# Altium project LiDAR_ToF_System.PrjPcb
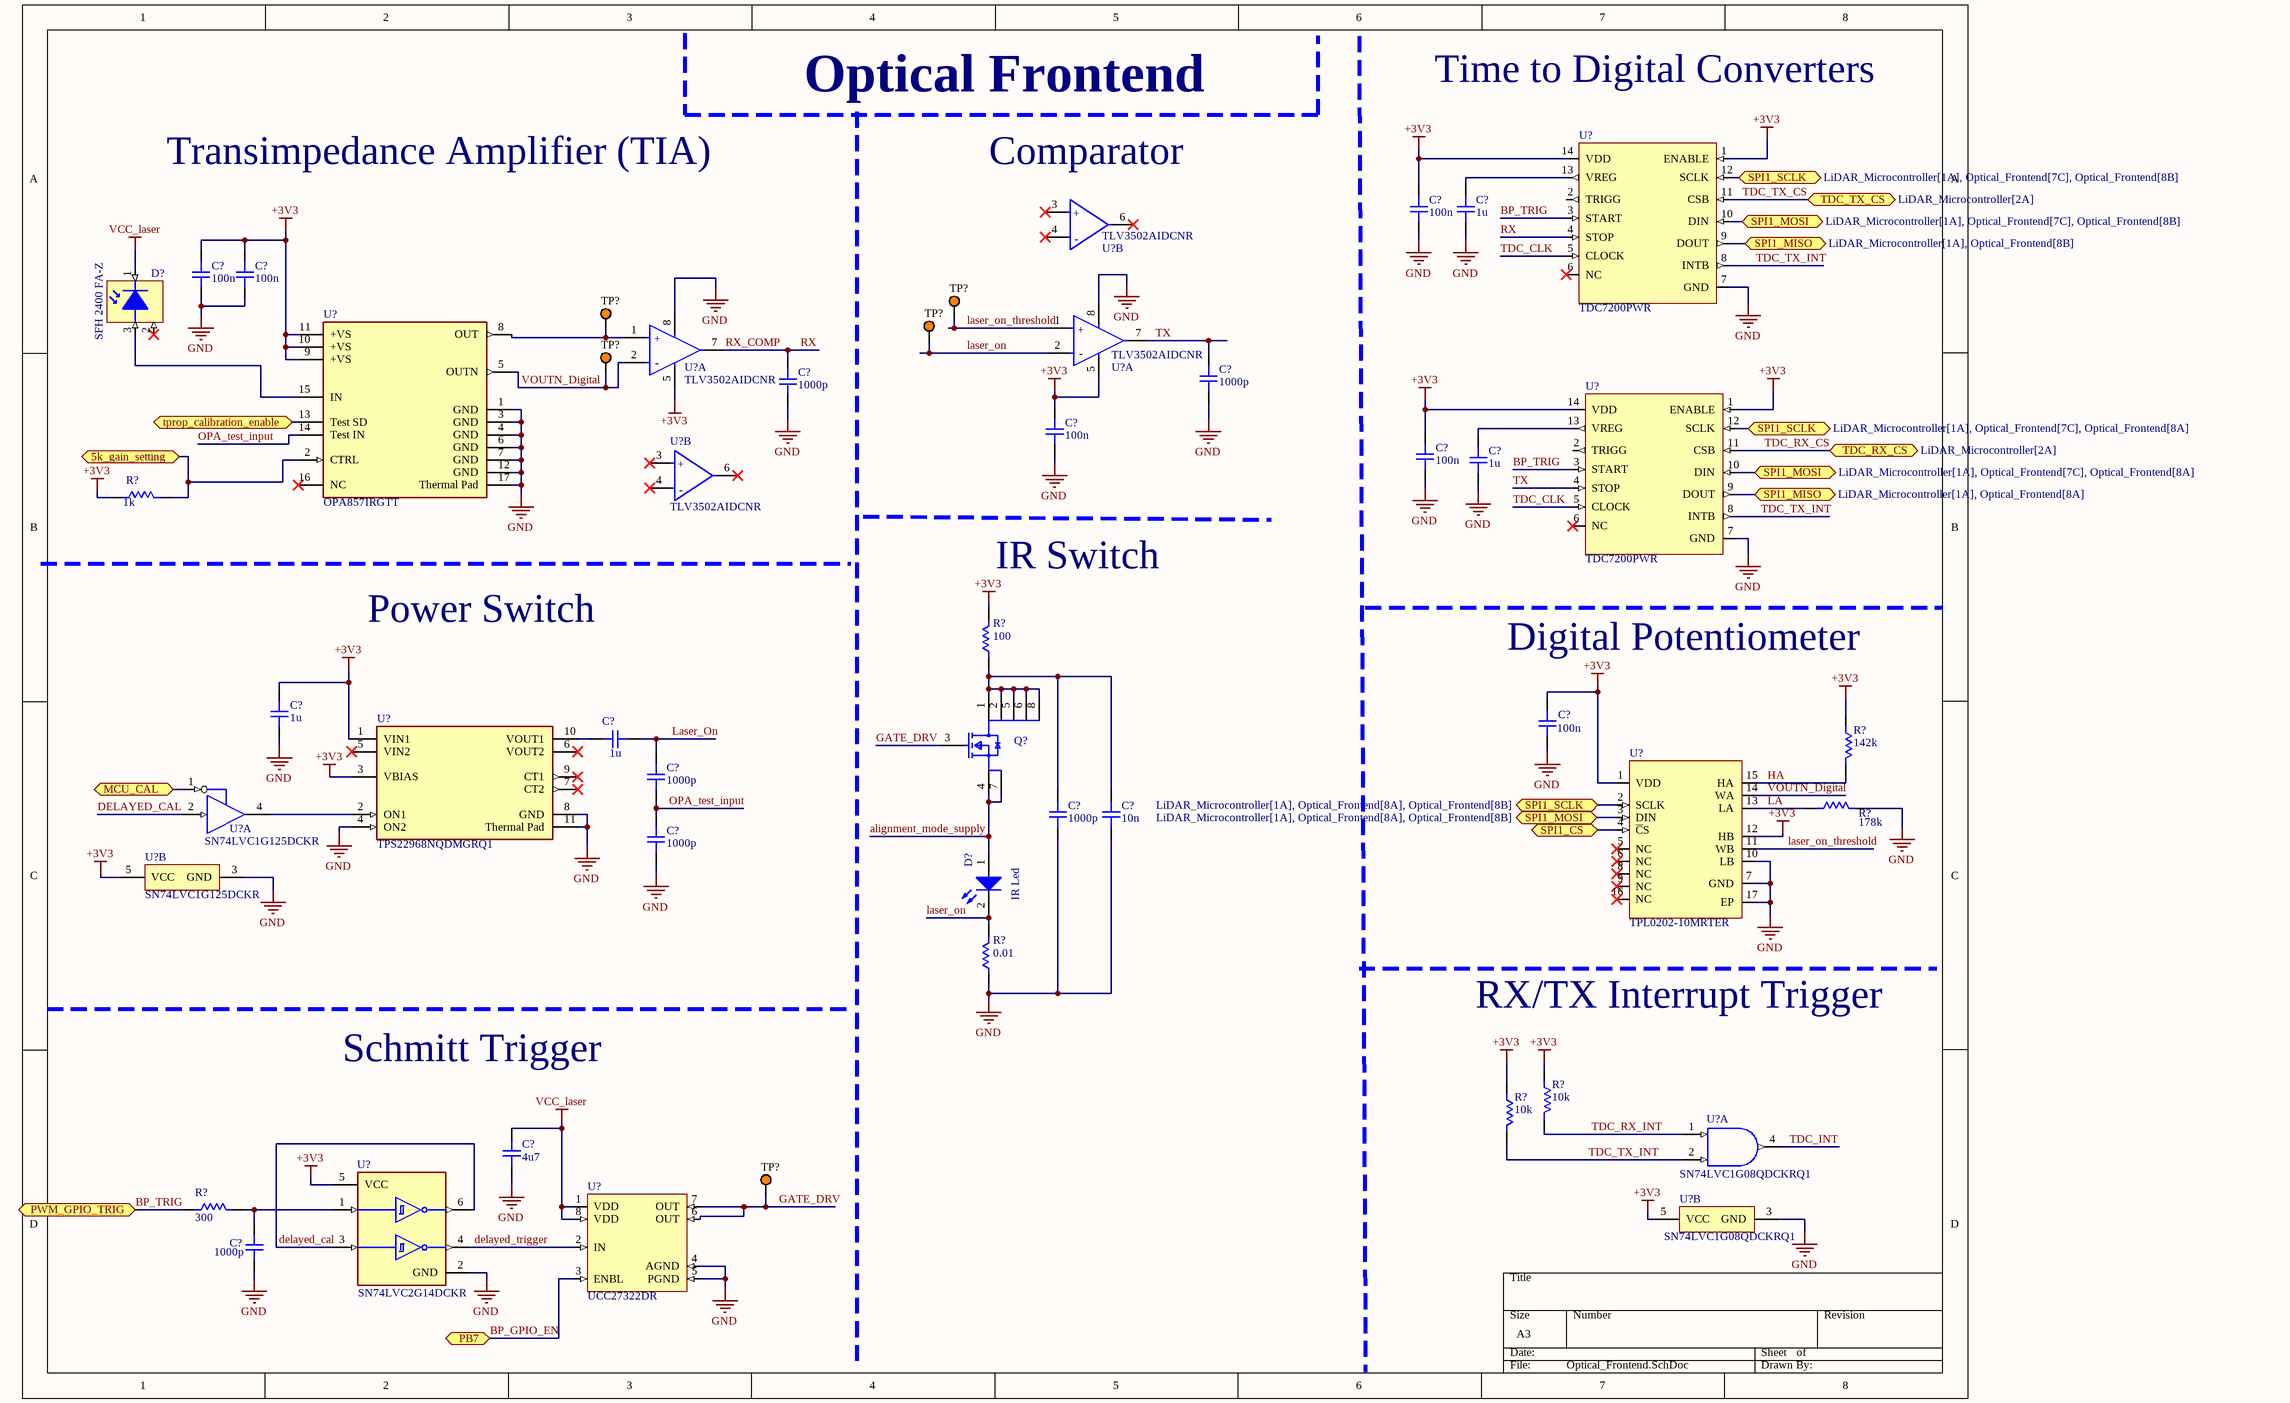
[diagram p0: Optical_Frontend.SchDoc]
2 sheets, 112 parts. Net scope: flat (ports and power ports of the same name join across sheets).
Board file: LiDAR_ToF_System.PcbDoc
Sheets:
  Optical_Frontend.SchDoc
  LiDAR_Microcontroller.SchDoc

## Sheet Optical_Frontend.SchDoc
size A3; SheetNumber: 1; SheetTotal: 2

### Parts
(Parts that share a designator on the sheet are numbered #1, #2 ... from top to bottom, then left to right.)
C?#1  100n  [CAP_0603]
C?#2  1u  [CAP_0603]
C?#3  100n  [CAP_0603]
C?#4  100n  [CAP_0603]
C?#5  1000p  [CAP_0603]
C?#6  1000p  [CAP_0603]
C?#7  100n  [CAP_0603]
C?#8  100n  [CAP_0603]
C?#9  1u  [CAP_0603]
C?#10  1u  [CAP_0603]
C?#11  100n  [CAP_0603]
C?#12  1u  [CAP_0603]
C?#13  1000p  [CAP_0603]
C?#14  1000p  [CAP_0603]
C?#15  10n  [CAP_0603]
C?#16  1000p  [CAP_0603]
C?#17  4u7  [CAP_0805]
C?#18  1000p  [CAP_0603]
D?#1  SFH 2400 FA-Z  [SFH 2400 FA-Z]
D?#2  IR Led  [WL-SITW_3528_L3.5W2.8H1.9]
Q?#1  CSD15571Q2  [FP-DQK0006C-MFG]  (value not drawn)
R?#1  1k  [RES_0603]
R?#2  100  [RES_0603]
R?#3  142k  [RES_0805]
R?#4  178k  [RES_0805]
R?#5  0.01  [RES_0805]
R?#6  10k  [RES_0603]
R?#7  10k  [RES_0603]
R?#8  300  [RES_0805]
TP?#1  5013  [KSTN-5013_V]  (value not drawn)
TP?#2  5013  [KSTN-5013_V]  (value not drawn)
TP?#3  5013  [KSTN-5013_V]  (value not drawn)
TP?#4  5013  [KSTN-5013_V]  (value not drawn)
TP?#5  5013  [KSTN-5013_V]  (value not drawn)
U?#1  TLV3502AIDCNR  [FP-DCN0008A-MFG]  (part B of 2)
U?#2  TDC7200PWR  [TDC7200PWR]
U?#3  OPA857IRGTT  [FP-RGT0016A-IPC_C]
U?#4  TLV3502AIDCNR  [FP-DCN0008A-MFG]  (part A of 2)
U?#5  TLV3502AIDCNR  [FP-DCN0008A-MFG]  (part A of 2)
U?#6  TLV3502AIDCNR  [FP-DCN0008A-MFG]  (part B of 2)
U?#7  TDC7200PWR  [TDC7200PWR]
U?#8  TPS22968NQDMGRQ1  [FP-DMG0010A-MFG]
U?#9  SN74LVC1G125DCKR  [DCK0005A_M]  (part A of 2)
U?#10  TPL0202-10MRTER  [TPL0202-10MRTER]
U?#11  SN74LVC1G125DCKR  [DCK0005A_M]  (part B of 2)
U?#12  SN74LVC1G08QDCKRQ1  [DCK0005A_M]  (part A of 2)
U?#13  SN74LVC2G14DCKR  [FP-DCK0006A-MFG]
U?#14  SN74LVC1G08QDCKRQ1  [DCK0005A_M]  (part B of 2)
U?#15  UCC27322DR  [UCC27614QDRQ1]

### Ports
5k_gain_setting (bidir), MCU_CAL (bidir), PB7 (bidir), PWM_GPIO_TRIG (bidir), SPI1_CS (bidir), SPI1_MISO (bidir, see LiDAR_Microcontroller[1A], Optical_Frontend[8A]), SPI1_MISO (bidir, see LiDAR_Microcontroller[1A], Optical_Frontend[8B]), SPI1_MOSI (bidir, see LiDAR_Microcontroller[1A], Optical_Frontend[7C], Optical_Frontend[8A]), SPI1_MOSI (bidir, see LiDAR_Microcontroller[1A], Optical_Frontend[7C], Optical_Frontend[8B]), SPI1_MOSI (bidir, see LiDAR_Microcontroller[1A], Optical_Frontend[8A], Optical_Frontend[8B]), SPI1_SCLK (bidir, see LiDAR_Microcontroller[1A], Optical_Frontend[7C], Optical_Frontend[8A]), SPI1_SCLK (bidir, see LiDAR_Microcontroller[1A], Optical_Frontend[7C], Optical_Frontend[8B]), SPI1_SCLK (bidir, see LiDAR_Microcontroller[1A], Optical_Frontend[8A], Optical_Frontend[8B]), TDC_RX_CS (bidir, see LiDAR_Microcontroller[2A]), TDC_TX_CS (bidir, see LiDAR_Microcontroller[2A]), tprop_calibration_enable (bidir)

### Nets
+3V3: C?#1.2 C?#3.2 C?#4.2 C?#7.2 C?#8.2 C?#10.2 C?#11.2 R?#1.1 R?#2.2 R?#3.2 R?#6.2 R?#7.2 U?#2.1(ENABLE) U?#2.14(VDD) U?#3.9(+VS) U?#3.10(+VS) U?#3.11(+VS) U?#4.5(V-) U?#5.5(V-) U?#7.1(ENABLE) U?#7.14(VDD) U?#8.1(VIN1) U?#8.3(VBIAS) U?#10.1(VDD) U?#10.12(HB) U?#11.5(VCC) U?#13.5(VCC) U?#14.5(VCC)
GND: C?#1.1 C?#2.1 C?#3.1 C?#4.1 C?#5.1 C?#6.1 C?#7.1 C?#8.1 C?#9.1 C?#10.1 C?#11.1 C?#14.1 C?#15.1 C?#16.1 C?#17.1 C?#18.1 R?#4.2 R?#5.1 U?#2.7(GND) U?#3.1(GND) U?#3.3(GND) U?#3.4(GND) U?#3.6(GND) U?#3.7(GND) U?#3.12(GND) U?#3.17(Thermal_Pad) U?#4.8(V+) U?#5.8(V+) U?#7.7(GND) U?#8.4(ON2) U?#8.8(GND) U?#8.11(Thermal_Pad) U?#10.7(GND) U?#10.10(LB) U?#10.17(EP) U?#11.3(GND) U?#13.2(GND) U?#14.3(GND) U?#15.4(AGND) U?#15.5(PGND)
VCC_laser: C?#17.2 D?#1.1(Cathode) U?#15.1(VDD) U?#15.8(VDD)
alignment_mode_supply: D?#2.1(A) Q?#1.4(S) Q?#1.7(S)
BP_GPIO_EN: U?#15.3(ENBL) ; port PB7
BP_TRIG: R?#8.1 U?#2.3(START) U?#7.3(START) ; port PWM_GPIO_TRIG
DELAYED_CAL: U?#9.2(A) U?#13.3(2A) U?#13.6(1Y)
delayed_trigger: U?#13.4(2Y) U?#15.2(IN)
GATE_DRV: Q?#1.3(G) TP?#5.1 U?#15.6(OUT) U?#15.7(OUT)
HA: R?#3.1 U?#10.15(HA)
LA: R?#4.1 U?#10.13(LA)
Laser_On: C?#12.1 C?#13.2 D?#2.2(K) R?#5.2 TP?#3.1 U?#4.2(-IN_A)
laser_on_threshold: TP?#1.1 U?#4.1(+IN_A) U?#10.11(WB)
OPA_test_input: C?#13.1 C?#16.2 U?#3.14(Test_IN)
RX: C?#5.2 U?#2.4(STOP) U?#5.7(OUT_A)  [also labelled RX_COMP]
SPI1_MISO: U?#2.9(DOUT) U?#7.9(DOUT) ; port SPI1_MISO
SPI1_MOSI: U?#2.10(DIN) U?#7.10(DIN) U?#10.3(DIN) ; port SPI1_MOSI
SPI1_SCLK: U?#2.12(SCLK) U?#7.12(SCLK) U?#10.2(SCLK) ; port SPI1_SCLK
TDC_CLK: U?#2.5(CLOCK) U?#7.5(CLOCK)
TDC_INT: U?#12.4(Y)
TDC_RX_CS: U?#7.11(CSB) ; port TDC_RX_CS
TDC_RX_INT: R?#6.1 U?#12.1(A)
TDC_TX_CS: U?#2.11(CSB) ; port TDC_TX_CS
TDC_TX_INT: R?#7.1 U?#2.8(INTB) U?#7.8(INTB) U?#12.2(B)
TX: C?#6.2 U?#4.7(OUT_A) U?#7.4(STOP)
VOUTN_Digital: TP?#4.1 U?#3.5(OUTN) U?#5.2(-IN_A) U?#10.14(WA)
NetC?#2_2: C?#2.2 U?#2.13(VREG)
NetC?#9_2: C?#9.2 U?#7.13(VREG)
NetC?#12_2: C?#12.2 U?#8.10(VOUT1)
NetC?#14_2: C?#14.2 C?#15.2 Q?#1.1(D) Q?#1.2(D) Q?#1.5(D) Q?#1.6(D) Q?#1.8(D) R?#2.1
NetC?#18_2: C?#18.2 R?#8.2 U?#13.1(1A)
NetD?#1_3: D?#1.3(Anode) U?#3.15(IN)
NetR?#1_2: R?#1.2 U?#3.2(CTRL) ; port 5k_gain_setting
NetTP?#2_1: TP?#2.1 U?#3.8(OUT) U?#5.1(+IN_A)
NetU?#3_13: U?#3.13(Test_SD) ; port tprop_calibration_enable
NetU?#8_2: U?#8.2(ON1) U?#9.4(Y)
NetU?#9_1: U?#9.1(~{OE}) ; port MCU_CAL
NetU?#10_4: U?#10.4(~{C}S) ; port SPI1_CS

Not connected (* = marked no-connect by the designer): D?#1 2(NC)*; U?#1 3(+IN_B)* 4(-IN_B)* 6(OUT_B)*; U?#2 2(TRIGG) 6(NC)*; U?#3 16(NC)*; U?#6 3(+IN_B)* 4(-IN_B)* 6(OUT_B)*; U?#7 2(TRIGG) 6(NC)*; U?#8 5(VIN2)* 6(VOUT2)* 7(CT2)* 9(CT1)*; U?#10 5(NC)* 6(NC)* 8(NC)* 9(NC)* 16(NC)*

### Notes on the sheet
- Optical Frontend
- Time to Digital Converters
- Transimpedance Amplifier (TIA)
- (near U?#1) Comparator
- (near R?#2) IR Switch
- Power Switch
- Digital Potentiometer
- RX/TX Interrupt Trigger
- Schmitt Trigger
- (in symbol CMP-04896-000006-1, part A) +; -
- (in symbol CMP-04896-000006-1, part B) +; -

### Library data of the parts
C?#1 C?#3 C?#4 C?#7 C?#8 C?#11 = MAJCH168BB7104KTEA01: Multilayer Ceramic Capacitors MLCC - SMD/SMT 100V 0.1uF 0603 X7R 10% AECQ2; Manufacturer: TAIYO YUDEN; Rating: 100nF 100V X7R 0603 10%; Manufacturer Part Number: MAJCH168BB7104KTEA01; Distributor Link: https://www.mouser.tw/en/ProductDetail/TAIYO-YUDEN/MAJCH168BB7104KTEA01?qs=ZcfC38r4PovaTBrG0IdezQ%3D%3D; Datasheet Link: https://www.mouser.com/catalog/specsheets/TAIYO_YUDEN_03-08-2024_MAJCH168BB7104KTEA01_SS.pdf?_gl=1*17qbpp1*_gcl_aw*R0NMLjE3ODUyMjg2NDkuQ2p3S0NBandwcUhUQmhBY0Vpd0FqMkFmdXJYOV9OUy1CV0xFSmd6T0FaYy1HZXR1bHVfaUZmaHVzRkI2bHhkODVUMjVSNlJWbnBOUkFob0NEdHNRQXZEX0J3RQ..*_gcl_au*MTM0NzYwMzc0Mi4xNzgyNDQ3MDMwLjE4MDQ0Nzg2ODUuMTc4NTI5MDg4OS4xNzg1MjkxOTE2LjE1NDk0Mzk5MTcuMTc4NTIxODYwOC4xNzg1MjkxOTE2*_ga*MTg5NTU5OTIyLjE3ODI0NDcwMzM.*_ga_15W4STQT4T*czE3ODUyODM3NTgkbzk5JGcxJHQxNzg1MjkxOTI1JGo0MiRsMCRoMA..; Dielectric: *
C?#2 C?#9 C?#10 C?#12 = C1608X7R2A105K080AC: MLCC - SMD/SMT Commercial Grade,MLCC,0603,X7R,100V,1uF,+/-10%,0.8mm; Manufacturer Name: TDK; ComponentLink1Description: Datasheet Link 1; ComponentLink1URL: https://product.tdk.com/system/files/dam/doc/product/capacitor/ceramic/mlcc/catalog/mlcc_commercial_general_en.pdf; Distributor Name: Mouser; ComponentLink2Description: Distributor Link 1; ComponentLink2URL: https://www.mouser.tw/zh/ProductDetail/TDK/C1608X7R2A105K080AC?qs=efUn273yAhc5BfjaNflQJg%3D%3D
C?#5 C?#6 C?#13 C?#14 C?#16 C?#18 = KAM15AR71H102KM: Multilayer Ceramic Capacitors MLCC - SMD/SMT 50V 1000pF X7R 0603 10% AEC-Q200; Manufacturer: KYOCERA AVX; Rating: 1nF 50V X7R 10%; Manufacturer Part Number: KAM15AR71H102KM; Distributor Link: https://www.mouser.tw/en/ProductDetail/KYOCERA-AVX/KAM15AR71H102KM?qs=OcgtsXO%252B3guc58RvGZLAWA%3D%3D; Datasheet Link: https://ele.kyocera.com/assets/products/capacitor/KGM_Series_e.pdf; Dielectric: *
C?#15 = KAF15AR71H103JM: Multilayer Ceramic Capacitors MLCC - SMD/SMT Automotive MLCC 0603, 10nF, 5%, X7R, 50VDC; Manufacturer: KYOCERA AVX; Rating: 10nF 50V X7R 0603 5%; Manufacturer Part Number: KAF15AR71H103JM; Distributor Link: https://www.mouser.tw/en/ProductDetail/KYOCERA-AVX/KAF15AR71H103JM?qs=sGAEpiMZZMvsSlwiRhF8qrQG6leidpLjNf3RmkJWfl3qRaUgdYaoYg%3D%3D; Datasheet Link: https://www.mouser.tw/datasheet/3/5926/1/AutoMLCCKAF.pdf; Dielectric: *
C?#17 = CGA4J1X7R1H475K125AC: Multilayer Ceramic Capacitors MLCC - SMD/SMT 0805 50VDC 4.7uF 10% AEC-Q200; Manufacturer: TDK; Rating: 4.7uF 50V X7R 10% 0805; Manufacturer Part Number: CGA4J1X7R1H475K125AC; Distributor Link: https://www.mouser.tw/en/ProductDetail/TDK/CGA4J1X7R1H475K125AC?qs=PqoDHHvF64%252BmskN2S82T2g%3D%3D; Datasheet Link: https://product.tdk.com/system/files/dam/doc/product/capacitor/ceramic/mlcc/catalog/mlcc_automotive_general_en.pdf?ref_disty=mouser; Dielectric: *
D?#1 = SFH 2400 FA-Z: Silicon PIN Photodiode, SMD; Manufacturer Name: ams OSRAM; ComponentLink1Description: Datasheet Link; ComponentLink1URL: https://www.mouser.com/datasheet/3/5912/1/SFH_2400_FA_EN.pdf; ComponentLink2Description: Distributor Link; ComponentLink2URL: https://www.mouser.com/en/ProductDetail/ams-OSRAM/SFH-2400-FA-Z?qs=K5ta8V%252BWhtYSGJkl7DYwdw%3D%3D; Manufacturer Part Number: SFH 2400 FA-Z
D?#2 = CMP-03913-90235593-3: WL-SITW SMT InfraRed TopLED Waterclear; Manufacturer Lifecycle Status: ACTIVE; Forward Voltage: 1.4V; Wavelength: 940nm; Max Reverse Voltage (DC): 5V; Viewing Angle: 120°; YEOL: 1 = Estimated lifetime > 10 years; Forward Current: 700mA; RoHS: Compliant; Max Operating Temperature: 85°C; Length: 3.2mm; Peak Wavelength: 940nm; Min Operating Temperature: -40°C; Width: 2.8mm; Height: 1.9mm; Lifecycle Status: Production; Packaging: Tape and Reel
Q?#1 = CMP-04962-000051-1: MOSFET N-CH 20V 22A 6SON; Rds On Max: 15mR; Power Dissipation: 2.5W; Turn-Off Delay Time: 9.9ns; Number of Elements: 2; Number of Channels: 1; Turn-On Delay Time: 17.2ns; Input Capacitance: 419pF; Fall Time: 4.1ns; Drain to Source Resistance: 19.2mR; Element Configuration: Single; Contact Plating: Tin; Drain to Source Voltage (Vdss): 20V; Number of Pins: 6; Max Power Dissipation: 2.5W; Min Operating Temperature: -55°C; Max Operating Temperature: 150°C; Packaging: Tape and Reel; Rise Time: 17.2ns; Mount: Surface Mount; Gate to Source Voltage (Vgs): 20V; Drain to Source Breakdown Voltage: 20V; Lead Free: Lead Free; Continuous Drain Current (ID): 22A; Package Quantity: 3000
R?#1 = AC0603JR-071KL: Thick Film Resistors - SMD 1 kOhms 1/10 W 75 V 5% 0603 100 PPM / C - 55 C / + 155 C AEC-Q200; Manufacturer: YAGEO; Values: 1k 1/10W 5% 0603; Manufacturer Part Number: AC0603JR-071KL; Distributor Link: https://www.mouser.tw/en/ProductDetail/YAGEO/AC0603JR-071KL?qs=ygRr%2FtkhtetUuJMpTs3DCw%3D%3D; Datasheet Link: https://www.mouser.tw/datasheet/3/508/1/PYU_AC_51_ROHS_L.pdf
R?#2 = CRCW0603100RJNEBC: Thick Film Resistors - SMD 1/10Watt 100ohms 5% 0603 Commercial Use; Manufacturer: Vishay; Values: 100ohm 1/10W 5% 0603; Manufacturer Part Number: CRCW0603100RJNEBC; Distributor Link: https://www.mouser.tw/en/ProductDetail/YAGEO/RT0603WRE07100RL?qs=sGAEpiMZZMtlubZbdhIBIKm0gsRX2fVkkBVJnMJ1ydc%3D; Datasheet Link: https://www.vishay.com/docs/20035/dcrcwe3.pdf
R?#3 = TNPW0805142KBETA: Thin Film Resistors - SMD TNPW-0805 142K 0.1% T-9 RT1; Manufacturer: Vishay; Manufacturer Part Number: RT0805BRD07142KL; Ratings: 142 k, 0.1%, 0.125 W, 0805; Distributor Link: https://www.mouser.com/en/ProductDetail/Vishay/TNPW0805142KBETA?qs=vmHwEFxEFR87BNEIEEmbQw%3D%3D
R?#4 = RT0805BRD07178KL: Thin Film Resistors - SMD 1/8W 178K ohm .1% 25ppm; Manufacturer: Yageo America; Ratings: 178 k, 0.1%, 0.125 W, 0805; Manufacturer Part Number: RT0805BRD07178KL; Distributor Link: https://www.mouser.com/en/ProductDetail/YAGEO/RT0805BRD07178KL?qs=TvbiuNL4H84pel0CAYOXAQ%3D%3D; ComponentLink1Description: Datasheet Link; ComponentLink1URL: https://www.mouser.com/datasheet/3/72/1/PYU_RT_1_TO_0_01_ROHS_L.pdf
R?#5 = WSL0805R0100FEA18: Current Sense Resistors - SMD 1/4watt .01ohms 1%; Manufacturer: Yageo America; Ratings: 0.01, 1%, 0.25 W, 0805; Manufacturer Part Number: WSL0805R0100FEA18; Distributor Link: https://www.mouser.com/en/ProductDetail/Vishay-Dale/WSL0805R0100FEA18?qs=fncU5wK7Cm%252BOEp0dgHdc7A%3D%3D; ComponentLink1Description: Datasheet Link; ComponentLink1URL: https://www.vishay.com/doc?31057
R?#6 R?#7 = CRCW060310K0FKEI: Thick Film Resistors - SMD 10K OHM 1%; Manufacturer: Vishay; Value: 10k 1% 1/8W 0603; Manufacturer Part Number: CRCW060310K0FKEI; Distributor Link: https://www.vishay.com/docs/20035/dcrcwe3.pdf
R?#8 = ERJ-6GEYJ301V: Thick Film Resistors - SMD 0805 300ohms 5% AEC-Q200 / RES, 300, 5%, 0.125 W, 0805; Manufacturer: Panasonic; Manufacturer Part Number: ERJ-6GEYJ301V; Distributor Link: https://www.mouser.com/en/ProductDetail/Panasonic-Industry/ERJ-6GEYJ301V?qs=tQNqqtTOejJLN%2FpK89Mq5w%3D%3D; Datasheet Link: https://industrial.panasonic.com/cdbs/www-data/pdf/RDO0000/RDO0000C334.pdf; Ratings: 300, 5%, 0.125 W, 0805
TP?#1-TP?#5 = CMP-1672-00005-4: Test Point, Orange, Through Hole, RoHS, Bulk; Manufacturer: Keystone; REACH SVHC: No SVHC; ComponentLink2Description: Datasheet; PackageDescription: 1-Pin Through Hole Device, Dia 3.17 mm; Package Quantity: 100; PackageReference: 5013; Contact Material: Bronze; DatasheetVersion: Rev. F, 12/2013; ComponentLink2URL: http://www.keyelco.com/product-pdf.cfm?p=1322; Contact Plating: Silver; ComponentLink1URL: http://www.keyelco.com/; Packaging: Bulk; ComponentLink1Description: Manufacturer URL; Colour: Orange; Height: 8.12 mm; RoHSCompliant: True; Mount: Through Hole; Mounting Technology: Through Hole
U?#1 U?#4-U?#6 = CMP-04896-000006-1: IC COMPARATOR R-R HI-SPD SOT23-8; Manufacturer: Texas Instruments; Standoff Height: 0mm; Number Of Channels: 2; Input Bias Current: 0.000002uA; Max Dual Supply Voltage: 2.75V; Max Supply Voltage: 5.5V; Min Dual Supply Voltage: 1.35V; Min Supply Voltage: 2.7V; Nominal Supply Current: 3.2mA; Input Offset Voltage: 1mV; Max Junction Temp: +150°C; Ambient Temperature Range Low: -40°C; Ambient Temperature Range High: +125°C; Temperature Range High: +125°C; Mouser Description: Analog Comparators 4.5ns Rail-to-Rail Comparator; RoHS: TRUE; Temperature: -40°C to +125°C; Manufacturer Part Number: TLV3502AIDCNR; ComponentLink2Description: Datasheet; Lead Free: Yes; Package: DCN0008A; Device Class L2: Linear ICs; Octopart: https://octopart.com/tlv3502aidcnr-texas+instruments-841436; Height: 1.45mm; Digikey Description: IC COMPARATOR R-R HI-SPD SOT23-8; Device Class L1: Integrated Circuits (ICs); ComponentLink2URL: http://www.ti.com/lit/ds/symlink/tlv3502.pdf; Temperature Range Low: -40°C; Automotive: No; Category: IC; Device Class L3: Comparators
U?#2 U?#7 = TDC7200PWR: Sensor Interface Time-to-digital conv erter for time-of-f A 595-TDC7200PW; Manufacturer Name: Texas Instruments; ComponentLink1Description: Datasheet Link; ComponentLink1URL: https://www.ti.com/lit/gpn/tdc7200; ComponentLink2Description: Distributor Link; ComponentLink2URL: https://www.mouser.tw/en/ProductDetail/Texas-Instruments/TDC7200PWR?qs=Q2snjRlG%2FBJNiMilyUsr3A%3D%3D
U?#3 = CMP-04895-000324-1: IC OPAMP GP 1 CIRCUIT 16VQFN; Min Supply Voltage: 2.6V; Number of Channels: 1; Output Current per Channel: 50mA; Slew Rate: 220V/µs; Operating Supply Current: 23.4mA; Max Supply Voltage: 3.6V; Gain Bandwidth Product: 6.8GHz; -3db Bandwidth: 130MHz; Input Bias Current: 1uA; REACH SVHC: No SVHC; Number of Pins: 16; Min Operating Temperature: -40°C; Mount: Surface Mount; Number of Circuits: 1; Max Operating Temperature: 95°C; Packaging: Cut Tape; Max Input Current: 23.4mA; RoHS Compliant: Yes; Lead Free: Lead Free; Case/Package: QFN
U?#8 = CMP-04910-000102-1: IC PWR SWITCH N-CHAN 1:1 10WSON; Output Configuration: High Side; Interface: On/Off; Number of Outputs: 2; Max Output Current: 4A; Lead Free: Lead Free; Max Operating Temperature: 125°C; Min Operating Temperature: -40°C; RoHS Compliant: Yes; Packaging: Tape and Reel; Number of Channels: 2
U?#9 U?#11 = CMP-0859-00281-3: Single Bus Buffer Gate With 3-State Outputs, DCK0005A, LARGE T&R; Manufacturer: Texas Instruments; Bits(#): 1; tpd @ Nom Voltage(Max)(ns): 9,5.5,4.5,4; 3-State Output: Yes; Output Type: CMOS; Sub-Family: Non-Inverting Buffer/Driver; Logic: True; Output Drive (IOL/IOH)(Max)(mA): 32/-32; Voltage(Nom)(V): 1.8,2.5,3.3,5; ICC @ Nom Voltage(Max)(mA): 0.01; Technology Family: LVC; VCC(Min)(V): 1.65; VCC(Max)(V): 5.5; F @ Nom Voltage(Max)(Mhz): 150; Rating: Catalog; Input Type: CMOS/TTL; Schmitt Trigger: No; PackageReference: DCK0005A; Generic Part Number: SN74LVC1G125; DatasheetVersion: SCES223T; Operating Temperature Range(C): -40 to 125,-40 to 85
U?#10 = TPL0202-10MRTER: TPL0202 256-Taps Dual Channel Digital Potentiometer With SPI and Non-Volatile Memory; Manufacturer Name: Texas Instruments; ComponentLink1Description: Datasheet Link; ComponentLink1URL: https://www.ti.com/lit/ds/symlink/tpl0202-10.pdf?ts=1786782222055; ComponentLink2Description: Distributor Link; ComponentLink2URL: https://www.mouser.tw/en/ProductDetail/Texas-Instruments/TPL0202-10MRTER?qs=O1HRStiETCjiIaUc6hg4xg%3D%3D
U?#12 U?#14 = CMP-0859-00272-3: Automotive Catalog Single 2-Input Positive-AND Gate, DCK0005A, LARGE T&R; Manufacturer: Texas Instruments; Generic Part Number: SN74LVC1G08-Q1; Bits(#): 1; VCC(Min)(V): 1.65; Output Drive (IOL/IOH)(Max)(mA): 32/-32; Output Type: CMOS; Input Type: CMOS/TTL; Schmitt Trigger: No; ICC @ Nom Voltage(Max)(mA): 0.01; Technology Family: LVC; tpd @ Nom Voltage(Max)(ns): 8,5.5,4.5,4; Voltage(Nom)(V): 1.8,2.5,3.3,5; F @ Nom Voltage(Max)(Mhz): 150; VCC(Max)(V): 5.5; Gate Type: AND; Logic: True; PackageReference: DCK0005A; Rating: Automotive; DatasheetVersion: SCES556F; 3-State Output: No; Operating Temperature Range(C): -40 to 125,-40 to 85; Sub-Family: AND Gate
U?#13 = CMP-0859-00454-5: IC INVERTER SCHMITT 2CH SC70-6; Logic Function: Inverting; Max Supply Voltage: 5.5V; Propagation Delay: 9.5ns; Number of Elements: 2; Max Output Current: 32mA; High Level Output Current: -32mA; Min Supply Voltage: 1.65V; Number of Inputs: 1; Quiescent Current: 10uA; Radiation Hardening: No; Max Operating Temperature: 125°C; Packaging: Tape and Reel; Termination: SMD/SMT; Lead Free: Lead Free; RoHS Compliant: Yes; Contact Plating: Gold; Number of Bits: 2; Turn-On Delay Time: 9.5ns; Output Current: 32mA; Number of Circuits: 2; Mount: Surface Mount; Case/Package: SC; Low Level Output Current: 32mA; REACH SVHC: No SVHC; Number of Pins: 6; Package Quantity: 3000; Min Operating Temperature: -40°C; Number of Gates: 2; Weight: 8.8E-05oz
U?#15 = UCC27322DR: UCC2732x-Q1 Single 9-A High-Speed Low-Side MOSFET Driver With Enable; Manufacutrer Name: Texas Instruments; ComponentLink1Description: Distributor Link; ComponentLink1URL: https://www.mouser.com/en/ProductDetail/Texas-Instruments/UCC27322DR?qs=eJkN62t4xTW8JcQ%2FxDY%252BbQ%3D%3D&srsltid=AfmBOorF5uMu5K5oJ2uwjCfS-ChVb6PP3sk642Xibnc5-HeBSVreE6oL; ComponentLink2Description: Datasheet Link; ComponentLink2URL: https://www.ti.com/lit/gpn/ucc27321

## Sheet LiDAR_Microcontroller.SchDoc
size A3; SheetNumber: 2; SheetTotal: 2
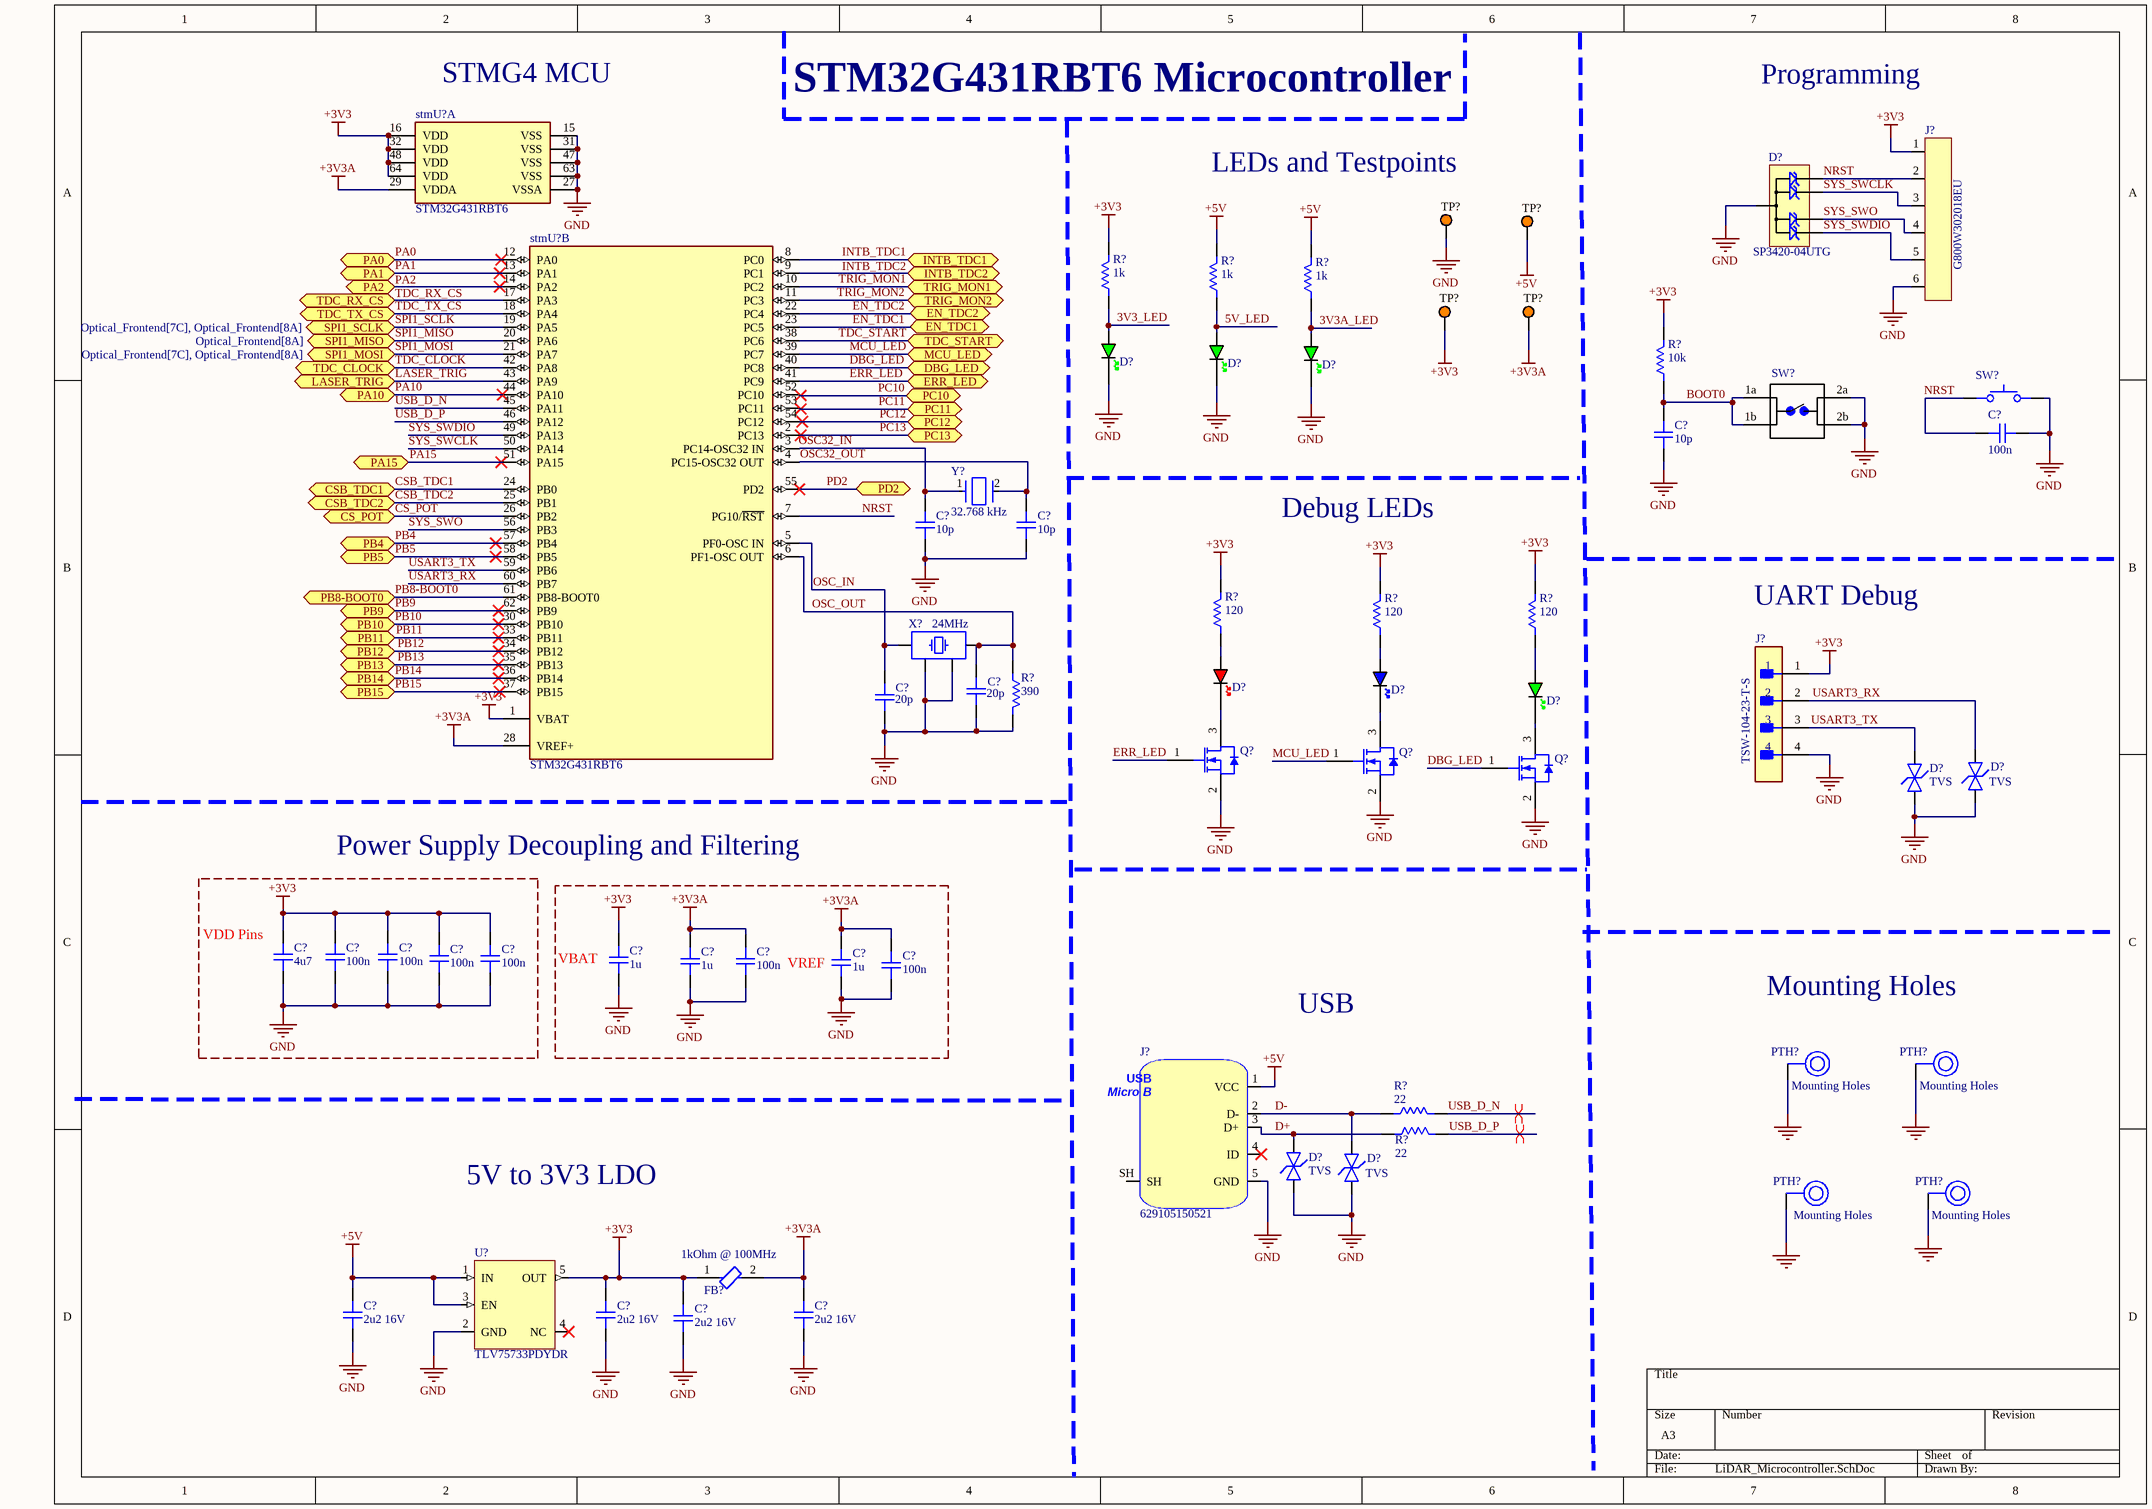
[diagram p1: LiDAR_Microcontroller.SchDoc]

### Parts
(Parts that share a designator on the sheet are numbered #1, #2 ... from top to bottom, then left to right.)
C?#19  100n  [CAP_0603]
C?#20  10p  [CAP_0603]
C?#21  10p  [CAP_0603]
C?#22  10p  [CAP_0603]
C?#23  20p  [CAP_0603]
C?#24  20p  [CAP_0603]
C?#25  4u7  [CAP_0805]
C?#26  100n  [CAP_0603]
C?#27  100n  [CAP_0603]
C?#28  100n  [CAP_0603]
C?#29  100n  [CAP_0603]
C?#30  1u  [CAP_0603]
C?#31  1u  [CAP_0603]
C?#32  100n  [CAP_0603]
C?#33  1u  [CAP_0603]
C?#34  100n  [CAP_0603]
C?#35  2u2 16V  [CAP_0603]
C?#36  2u2 16V  [CAP_0603]
C?#37  2u2 16V  [CAP_0603]
C?#38  2u2 16V  [CAP_0603]
D?#3  SP3420-04UTG  [uDFN-10]
D?#4  GREEN  [LED_0603_GREEN]  (value not drawn)
D?#5  GREEN  [LED_0603_GREEN]  (value not drawn)
D?#6  GREEN  [LED_0603_GREEN]  (value not drawn)
D?#7  RED  [LED_0603_RED]  (value not drawn)
D?#8  BLUE  [LED_0603_BLUE]  (value not drawn)
D?#9  GREEN  [LED_0603_GREEN]  (value not drawn)
D?#10  TVS  [D_0603]
D?#11  TVS  [D_0603]
D?#12  TVS  [D_0603]
D?#13  TVS  [D_0603]
FB?  1kOhm @ 100MHz  [FP-MPZ2012-MFG]
J?#1  G800W302018EU  [G800W302018EU]
J?#2  TSW-104-23-T-S  [FP-TSW-104-23-T-S-MFG]
J?#3  629105150521  [629105150521]
PTH?#1  Mounting Holes  [Mounting Hole]
PTH?#2  Mounting Holes  [Mounting Hole]
PTH?#3  Mounting Holes  [Mounting Hole]
PTH?#4  Mounting Holes  [Mounting Hole]
Q?#2  MGSF1N02LT1G  [ONSC-SOT-23-3-318-08_V]  (value not drawn)
Q?#3  MGSF1N02LT1G  [ONSC-SOT-23-3-318-08_V]  (value not drawn)
Q?#4  MGSF1N02LT1G  [ONSC-SOT-23-3-318-08_V]  (value not drawn)
R?#9  1k  [RES_0603]
R?#10  1k  [RES_0603]
R?#11  1k  [RES_0603]
R?#12  10k  [RES_0603]
R?#13  120  [RES_0402]
R?#14  120  [RES_0402]
R?#15  120  [RES_0402]
R?#16  390  [RES_0603]
R?#17  22  [RES_0402]
R?#18  22  [RES_0402]
stmU?#1  STM32G431RBT6  [FP-LQFP64-5W-MFG]  (part A of 2)
stmU?#2  STM32G431RBT6  [FP-LQFP64-5W-MFG]  (part B of 2)
SW?#1  SKRPANE010  [SKRPANE010]  (value not drawn)
SW?#2  Switch 6mm 24V (NO)  [Switch 6mm 24V (NO)]  (value not drawn)
TP?#6  5013  [KSTN-5013_V]  (value not drawn)
TP?#7  5013  [KSTN-5013_V]  (value not drawn)
TP?#8  5013  [KSTN-5013_V]  (value not drawn)
TP?#9  5013  [KSTN-5013_V]  (value not drawn)
U?#16  TLV75733PDYDR  [TLV75733PDYDR]
X?  24MHz  [XTAL_3225]
Y?  32.768 kHz  [FP-ABS07-MFG]

### Blocks framed on the sheet
Power Supply Decoupling and Filtering: C?#25-C?#29

### Ports
CS_POT (bidir), CSB_TDC1 (bidir), CSB_TDC2 (bidir), DBG_LED (bidir), EN_TDC1 (bidir), EN_TDC2 (bidir), ERR_LED (bidir), INTB_TDC1 (bidir), INTB_TDC2 (bidir), LASER_TRIG (bidir), MCU_LED (bidir), PA0 (bidir), PA1 (bidir), PA2 (bidir), PA10 (bidir), PA15 (bidir), PB4 (bidir), PB5 (bidir), PB8-BOOT0 (bidir), PB9 (bidir), PB10 (bidir), PB11 (bidir), PB12 (bidir), PB13 (bidir), PB14 (bidir), PB15 (bidir), PC10 (bidir), PC11 (bidir), PC12 (bidir), PC13 (bidir), PD2 (bidir), SPI1_MISO (bidir, see Optical_Frontend[8A]), SPI1_MOSI (bidir, see Optical_Frontend[7C], Optical_Frontend[8A]), SPI1_SCLK (bidir, see Optical_Frontend[7C], Optical_Frontend[8A]), TDC_CLOCK (bidir), TDC_RX_CS (bidir), TDC_START (bidir), TDC_TX_CS (bidir), TRIG_MON1 (bidir), TRIG_MON2 (bidir)

### Nets
+3V3: C?#25.2 C?#26.2 C?#27.2 C?#28.2 C?#29.2 C?#30.2 C?#36.2 C?#37.2 FB?.1 J?#1.1 J?#2.1 R?#9.2 R?#12.1 R?#13.2 R?#14.2 R?#15.2 stmU?#1.16(VDD) stmU?#1.32(VDD) stmU?#1.48(VDD) stmU?#1.64(VDD) stmU?#2.1(VBAT) TP?#8.1 U?#16.5(OUT)
+3V3A: C?#31.2 C?#32.2 C?#33.2 C?#34.2 C?#38.2 FB?.2 stmU?#1.29(VDDA) stmU?#2.28(VREF+) TP?#9.1
+5V: C?#35.2 J?#3.1(VCC) R?#10.2 R?#11.2 TP?#7.1 U?#16.1(IN) U?#16.3(EN)
GND: C?#19.1 C?#20.1 C?#21.1 C?#22.1 C?#23.1 C?#24.1 C?#25.1 C?#26.1 C?#27.1 C?#28.1 C?#29.1 C?#30.1 C?#31.1 C?#32.1 C?#33.1 C?#34.1 C?#35.1 C?#36.1 C?#37.1 C?#38.1 D?#3.38(GND) D?#4.K D?#5.K D?#6.K D?#10.A D?#11.A D?#12.A D?#13.A J?#1.6 J?#2.4 J?#3.5(GND) PTH?#1.1 PTH?#2.1 PTH?#3.1 PTH?#4.1 Q?#2.2(S) Q?#3.2(S) Q?#4.2(S) R?#16.1 stmU?#1.15(VSS) stmU?#1.27(VSSA) stmU?#1.31(VSS) stmU?#1.47(VSS) stmU?#1.63(VSS) SW?#1.34 SW?#2.2a SW?#2.2b TP?#6.1 U?#16.2(GND) X?.2 X?.4
3V3_LED: D?#4.A R?#9.1
3V3A_LED: D?#6.A R?#11.1
5V_LED: D?#5.A R?#10.1
BOOT0: C?#20.2 R?#12.2 SW?#2.1a SW?#2.1b
CS_POT: stmU?#2.26(PB2) ; port CS_POT
CSB_TDC1: stmU?#2.24(PB0) ; port CSB_TDC1
CSB_TDC2: stmU?#2.25(PB1) ; port CSB_TDC2
D+: D?#12.K J?#3.3(D+) R?#18.1
D-: D?#13.K J?#3.2(D-) R?#17.1
DBG_LED: Q?#4.1(G) stmU?#2.40(PC8) ; port DBG_LED
EN_TDC1: stmU?#2.23(PC5) ; port EN_TDC1
EN_TDC2: stmU?#2.22(PC4) ; port EN_TDC2
ERR_LED: Q?#2.1(G) stmU?#2.41(PC9) ; port ERR_LED
INTB_TDC1: stmU?#2.8(PC0) ; port INTB_TDC1
LASER_TRIG: stmU?#2.43(PA9) ; port LASER_TRIG
MCU_LED: Q?#3.1(G) stmU?#2.39(PC7) ; port MCU_LED
NRST: C?#19.2 D?#3.110 J?#1.2 stmU?#2.7(PG10/~{RST}) SW?#1.12
OSC32_IN: C?#21.2 stmU?#2.3(PC14-OSC32_IN) Y?.1
OSC32_OUT: C?#22.2 stmU?#2.4(PC15-OSC32_OUT) Y?.2
OSC_IN: C?#23.2 stmU?#2.5(PF0-OSC_IN) X?.1
OSC_OUT: C?#24.2 R?#16.2 stmU?#2.6(PF1-OSC_OUT) X?.3
PA0: stmU?#2.12(PA0) ; port PA0
PA1: stmU?#2.13(PA1) ; port PA1
PA10: stmU?#2.44(PA10) ; port PA10
PA15: stmU?#2.51(PA15) ; port PA15
PB4: stmU?#2.57(PB4) ; port PB4
PB5: stmU?#2.58(PB5) ; port PB5
PB8-BOOT0: stmU?#2.61(PB8-BOOT0) ; port PB8-BOOT0
PB9: stmU?#2.62(PB9) ; port PB9
PB10: stmU?#2.30(PB10) ; port PB10
PB11: stmU?#2.33(PB11) ; port PB11
PB12: stmU?#2.34(PB12) ; port PB12
PB13: stmU?#2.35(PB13) ; port PB13
PB14: stmU?#2.36(PB14) ; port PB14
PB15: stmU?#2.37(PB15) ; port PB15
PC10: stmU?#2.52(PC10) ; port PC10
PC11: stmU?#2.53(PC11) ; port PC11
PC12: stmU?#2.54(PC12) ; port PC12
PC13: stmU?#2.2(PC13) ; port PC13
PD2: stmU?#2.55(PD2) ; port PD2
SPI1_MISO: stmU?#2.20(PA6) ; port SPI1_MISO
SPI1_MOSI: stmU?#2.21(PA7) ; port SPI1_MOSI
SPI1_SCLK: stmU?#2.19(PA5) ; port SPI1_SCLK
SYS_SWCLK: D?#3.29 J?#1.3 stmU?#2.50(PA14)
SYS_SWDIO: D?#3.56 J?#1.5 stmU?#2.49(PA13)
SYS_SWO: D?#3.47 J?#1.4 stmU?#2.56(PB3)
TDC_CLOCK: stmU?#2.42(PA8) ; port TDC_CLOCK
TDC_RX_CS: stmU?#2.17(PA3) ; port TDC_RX_CS
TDC_START: stmU?#2.38(PC6) ; port TDC_START
TDC_TX_CS: stmU?#2.18(PA4) ; port TDC_TX_CS
TRIG_MON1: stmU?#2.10(PC2) ; port TRIG_MON1
TRIG_MON2: stmU?#2.11(PC3) ; port TRIG_MON2
USART3_RX: D?#11.K J?#2.2 stmU?#2.60(PB7)
USART3_TX: D?#10.K J?#2.3 stmU?#2.59(PB6)
USB_D_N: R?#17.2 stmU?#2.45(PA11)
USB_D_P: R?#18.2 stmU?#2.46(PA12)
NetD?#7_A: D?#7.A R?#13.1
NetD?#7_K: D?#7.K Q?#2.3(D)
NetD?#8_A: D?#8.A R?#14.1
NetD?#8_K: D?#8.K Q?#3.3(D)
NetD?#9_A: D?#9.A R?#15.1
NetD?#9_K: D?#9.K Q?#4.3(D)
NetstmU?#2_9: stmU?#2.9(PC1) ; port INTB_TDC2
NetstmU?#2_14: stmU?#2.14(PA2) ; port PA2

Not connected (* = marked no-connect by the designer): J?#3 4(ID)* SH; U?#16 4(NC)*

### Layout directives
differential pair; differential pair class USB_DIFF_PAIR: USB_D_N, USB_D_P

### Notes on the sheet
- (near stmU?#1) STMG4 MCU
- STM32G431RBT6 Microcontroller
- Programming
- (near TP?#6) LEDs and Testpoints
- Debug LEDs
- UART Debug
- (near C?#25) VDD Pins
- (near C?#30) VBAT
- (near C?#33) VREF
- USB
- Mounting Holes
- 5V to 3V3 LDO
- Labels drawn without touching a wire or pin: INTB_TDC2, PA2, TDC_RX_CS
- (in symbol 629105150521) USB; Micro B

### Library data of the parts
C?#19 C?#26-C?#29 C?#32 C?#34 = MAJCH168BB7104KTEA01: as C?#1 on sheet Optical_Frontend; Manufacturer Part Number: MAJCH168BB7104KTEA01; Distributor Link: https://www.mouser.tw/en/ProductDetail/TAIYO-YUDEN/MAJCH168BB7104KTEA01?qs=ZcfC38r4PovaTBrG0IdezQ%3D%3D; Datasheet Link: https://www.mouser.com/catalog/specsheets/TAIYO_YUDEN_03-08-2024_MAJCH168BB7104KTEA01_SS.pdf?_gl=1*17qbpp1*_gcl_aw*R0NMLjE3ODUyMjg2NDkuQ2p3S0NBandwcUhUQmhBY0Vpd0FqMkFmdXJYOV9OUy1CV0xFSmd6T0FaYy1HZXR1bHVfaUZmaHVzRkI2bHhkODVUMjVSNlJWbnBOUkFob0NEdHNRQXZEX0J3RQ..*_gcl_au*MTM0NzYwMzc0Mi4xNzgyNDQ3MDMwLjE4MDQ0Nzg2ODUuMTc4NTI5MDg4OS4xNzg1MjkxOTE2LjE1NDk0Mzk5MTcuMTc4NTIxODYwOC4xNzg1MjkxOTE2*_ga*MTg5NTU5OTIyLjE3ODI0NDcwMzM.*_ga_15W4STQT4T*czE3ODUyODM3NTgkbzk5JGcxJHQxNzg1MjkxOTI1JGo0MiRsMCRoMA..; Dielectric: *
C?#20-C?#22 = C0603C100K1RACTU: Multilayer Ceramic Capacitors MLCC - SMD/SMT 100V 10pF 10% X7R 0603; Manufacturer: KEMET; Rating: 10pF 100V 10% X7R 0603; Manufacturer Part Number: C0603C100K1RACTU; Distributor Link: https://www.mouser.tw/en/ProductDetail/KEMET/C0603C100K1RACTU?qs=hzBznG4dWXU4WScX4diOfA%3D%3D; Datasheet Link: https://www.mouser.tw/datasheet/3/508/1/KEM_C1002_X7R_SMD.pdf; Dielectric: *
C?#23 C?#24 = C0603C200J5RACTU: Multilayer Ceramic Capacitors MLCC - SMD/SMT 50V 20pF 5% X7R 0603; Manufacturer: KEMET; Rating: 20p 50V X7R 0603; Manufacturer Part Number: Multilayer Ceramic Capacitors MLCC - SMD/SMT 50V 20pF 5% X7R 0603; Distributor Link: https://www.mouser.tw/datasheet/3/72/1/KEM_C1002_X7R_SMD.pdf; LCSC: N/A; Dielectric: *
C?#25 = CGA4J1X7R1H475K125AC: as C?#17 on sheet Optical_Frontend; Manufacturer Part Number: CGA4J1X7R1H475K125AC; Distributor Link: https://www.mouser.tw/en/ProductDetail/TDK/CGA4J1X7R1H475K125AC?qs=PqoDHHvF64%252BmskN2S82T2g%3D%3D; Datasheet Link: https://product.tdk.com/system/files/dam/doc/product/capacitor/ceramic/mlcc/catalog/mlcc_automotive_general_en.pdf?ref_disty=mouser; Dielectric: *
C?#30 C?#31 C?#33 = C0603X105K9RACAUTO: Multilayer Ceramic Capacitors MLCC - SMD/SMT 6.3 Vo 1 uF 0603 X7R 10 % AECQ200; Manufacturer: KEMET; Rating: 1u 6.3V X7R 0603; Manufacturer Part Number: C0603X105K9RACAUTO; Distributor Link: https://www.mouser.tw/datasheet/3/72/1/C0603X105K9RACAUTO.pdf; LCSC: N/A; Dielectric: *
C?#35-C?#38 = 0603X225K160CT: Multilayer Ceramic Capacitors MLCC - SMD/SMT 2.2uF +-10% 16V; Manufacturer: Walsin; Rating: 2.2uF 16V 10% 0603 X5R; Manufacturer Part Number: 0603X225K160CT; Distributor Link: https://www.mouser.tw/en/ProductDetail/Walsin/0603X225K160CT?qs=sGAEpiMZZMsh%252B1woXyUXj9Vc%2FsqQGnyVueqjdyLsCyQ%3D; Datasheet Link: N/A; Dielectric: *
D?#3 = SP3420-04UTG: TVS Diode Array Low Capacitance ESD Protection 4-Channel (Vwork=3V3, Vclamp=6V); Manufacturer: Littelfuse; Manufacturer Part Number: SP3420-04UTG
D?#4-D?#6 D?#9 = LED_0603_GREEN: LED 0603 GREEN SMD
D?#7 = LED_0603_RED: LED 0603 RED SMD
D?#8 = LED_0603_BLUE: LED 0603 BLUE SMD
D?#10-D?#13 = D_TVS_BI_0603: Diode TVS / ESD Bidirectional 0603; Manufacturer: *; Manufacturer Part Number: *
FB? = CMP-08257-000025-1: FERRITE BEAD 1 KOHM 0805 1LN; Max Current Rating: 1.5A; Tolerance: 25%; Number of Lines: 1; DC Resistance (DCR): 150mR; Impedance: 1kR; Case Code (Metric): 2012; Mount: Surface Mount; Case/Package: 0805; Case Code (Imperial): 0805; Height: 0.041inch; Max DC Current: 1.5A; Min Operating Temperature: -55°C; Length: 0.079inch; Width: 1.25mm; Ratings: AEC-Q200; Packaging: Tape and Reel; RoHS Compliant: Yes; Termination: SMD/SMT; Test Frequency: 100MHz; Package Quantity: 4000; Weight: 0.000194oz; Max Operating Temperature: 125°C; Lead Free: Lead Free
J?#1 = G800W302018EU: Pin Header 6 Position 2.54mm Pitch; Manufacturer: Amphenol; Manufacturer Part Number: G800W302018EU
J?#2 = CMP-02766-001388-1: CONN HEADER VERT 4POS 2.54MM; Number of Contacts: 4; Gender: Male; Connector Type: Male Pin; Max Voltage Rating (AC): 550V; Max Current Rating: 7.6A; Radiation Hardening: No; Lead Free: Lead Free; RoHS Compliant: Yes; Contact Material: Bronze; Number of Positions: 4; Housing Color: Black; Min Operating Temperature: -55°C; Mount: Through Hole; Number of Rows: 1; Orientation: Straight; Contact Mating Length: 0.23inch; Contact Type: Male Pin; REACH SVHC: No SVHC; Max Operating Temperature: 105°C; Color: Black; Pitch: 2.54mm; Length: 10.16mm; Series: TSW; Packaging: Bulk; Contact Plating: Tin; Package Quantity: 1; Termination: Solder; Housing Material: Polyester; Width: 2.54mm; Depth: 2.54mm
J?#3 = 629105150521: USB Connector Type Micro B 2.0 SMD; Manufacturer: Wurth; Manufacturer Part Number: 629105150521; Distributor Link: https://www.mouser.de/ProductDetail/Wurth-Elektronik/629105150521?qs=a9WhcLg8qCzXiH7kZP8GRQ%3D%3D
PTH?#1-PTH?#4 = Mounting Holes: I'm so sick of having to manually make these everytime with a different size, and how in the world do do I make one like Phil's Lab with Gnd vias around it?
Q?#2-Q?#4 = CMP-1058-00777-1: Power MOSFET, 750 mA, 20 V, N-Channel, 3-Pin SOT-23, Pb-Free, Tape and Reel; Manufacturer: On Semiconductor; Crss Typ (pF): 45; Ciss Typ (pF): 125; VGS(th) Max (V): 2.4; Coss Typ (pF): 120; PD Max (W): 0.4; VGS Max (V): 20; Configuration: Single; Channel Polarity: N Channel; ID Max (A): 0.75; PackageReference: SOT-23-3-318-08; ComponentLink2Description: Datasheet; PackageVersion: Rev. AP, 11/2009; ComponentLink1URL: http://www.onsemi.com/; RoHS: Pb-Free; Mounting Technology: Surface Mount; Package Type: SOT-23-3; ComponentLink1Description: Manufacturer URL; V(BR)DSS Min (V): 20; PackageDescription: 3-Pin Small Outline Transistor, Body 2.92 x 1.3 mm, Pitch 0.95 mm; Packing: Tape and Reel; PartNumber: MGSF1N02LT1G; DatasheetVersion: Rev. 6; ComponentLink2URL: http://www.onsemi.cn/pub_link/Collateral/MGSF1N02LT1-D.PDF; ComponentLink3URL: http://www.onsemi.cn/pub_link/Collateral/318-08.PDF; ComponentLink3Description: Package Specification
R?#9-R?#11 = AC0603JR-071KL: as R?#1 on sheet Optical_Frontend; Manufacturer Part Number: AC0603JR-071KL; Distributor Link: https://www.mouser.tw/en/ProductDetail/YAGEO/AC0603JR-071KL?qs=ygRr%2FtkhtetUuJMpTs3DCw%3D%3D; Datasheet Link: https://www.mouser.tw/datasheet/3/508/1/PYU_AC_51_ROHS_L.pdf
R?#12 = CRCW060310K0FKEI: as R?#6 on sheet Optical_Frontend; Manufacturer Part Number: CRCW060310K0FKEI; Distributor Link: https://www.vishay.com/docs/20035/dcrcwe3.pdf
R?#13-R?#15 = CRCW0402120RFKED: Thick Film Resistors - SMD 1/10 Watt 120ohms 1%; Manufacturer: Vishay; Ratings: 120ohm 1/10W 1% 0402; Manufacturer Part Number: CRCW0402120RFKED; Distributor Link: https://www.mouser.tw/en/ProductDetail/Vishay/CRCW0402120RFKED?qs=sGAEpiMZZMtlubZbdhIBIFsfWmIKznfcAq4ywTsUxJY%3D; Datasheet: https://www.vishay.com/docs/20035/dcrcwe3.pdf
R?#16 = ERA-3VEB3900V: Thin Film Resistors - SMD 0603 0.1% 390ohm 25ppm SMD; Manufacturer: Panasonic; Ratings: 390ohm 0603 0.1% 1/8W; Manufacturer Part Number: ERA-3VEB3900V; Distributor Link: https://industrial.panasonic.com/cdbs/www-data/pdf/RDM0000/RDM0000C331.pdf; LCSC: N/A
R?#17 R?#18 = CRCW040222R0FKEE_1: Thick Film Resistors - SMD D10/CRCW0402 100 22R 1% EF4 E3; Manufacturer: Vishay; Ratings: 22ohm, 1/10W, 1%, 0402; Manufacturer Part Number: CRCW040222R0FKEE; Distributor Link: https://www.mouser.com/en/ProductDetail/Vishay/CRCW040222R0FKEE?qs=sGAEpiMZZMtlubZbdhIBIKbhzOdzan%2FGSLcVnipjjiw%3D; Datasheet Link: https://www.vishay.com/docs/20035/dcrcwe3.pdf
stmU?#1 stmU?#2 = CMP-12105-000150-1: IC MCU 32BIT 128KB FLASH 64LQFP; RoHS Compliant: Yes
SW?#1 = SKRPANE010: Tactile Switch SMD SPST; Manufacturer: Alps Alpine; Manufacturer Part Number: SKRPANE010
SW?#2 = CMP-007-0002-3: Switch Tactile OFF (ON) SPST Round Button PC Pins 0.05A 24VDC 100000Cycles 2.55N Thru-Hole Loose; Actuator Material: PBT; Contact Resistance: 100mR; Max Current Rating: 50mA; Actuator Color: Red; Switch Travel: 0.25mm; Illumination Type: Non-Illuminated,Illuminated; Actuator Type: Standard; Switch Function: Off-Mom; Actuator Length: 0.055inch; Max Voltage Rating (DC): 24V; Max Operating Temperature: 85°C; Depth: 7.8mm; Length: 5.99mm; Package Quantity: 750; Min Operating Temperature: -35°C; Mechanical Life: 100000Cycles; Mount: Through Hole; Voltage Rating (DC): 24V; Operating Force: 2.55N; Contact Plating: Silver; Electrical Life: 100000Cycles; Contact Current Rating: 50mA; Series: FSMJ; REACH SVHC: Unknown; Type: Switch; Lead Free: Lead Free; Contact Material: Copper Alloy; RoHS Compliant: Yes; Orientation: Straight; ELV: Compliant; Throw Configuration: SPST; Termination: PC Pins; Packaging: Loose Piece; Radiation Hardening: No
TP?#6-TP?#9 = CMP-1672-00005-4: as TP?#1 on sheet Optical_Frontend; REACH SVHC: No SVHC; ComponentLink2Description: Datasheet; PackageDescription: 1-Pin Through Hole Device, Dia 3.17 mm; Package Quantity: 100; PackageReference: 5013; Contact Material: Bronze; DatasheetVersion: Rev. F, 12/2013; ComponentLink2URL: http://www.keyelco.com/product-pdf.cfm?p=1322; Contact Plating: Silver; ComponentLink1URL: http://www.keyelco.com/; Packaging: Bulk; ComponentLink1Description: Manufacturer URL; Colour: Orange; Height: 8.12 mm; RoHSCompliant: True; Mount: Through Hole; Mounting Technology: Through Hole
U?#16 = TLV75733PDYDR: LDO Voltage Regulators 1-A low-IQ high-acc uracy low-dropout (L / Low dropout: / – 425mV (maximum) at 1A (3.3VOUT) / • Input voltage range: 1.45V to 5.5V; Manufacturer Name: Texas Instruments; ComponentLink1Description: Distributor Link; ComponentLink1URL: https://www.mouser.tw/en/ProductDetail/Texas-Instruments/TLV75733PDYDR?qs=ZcfC38r4PovvOY4HwNOrpQ%3D%3D; ComponentLink2Description: Datasheet Link; ComponentLink2URL: https://www.ti.com/lit/gpn/tlv757p; Ratings: Input voltage range: 1.45V to 5.5V
X? = TSX-3225_24.0000MF15X-AC: Crystal SMD 24MHz 10PPM 7pF 3225; Manufacturer: Epson; Manufacturer Part Number: TSX-3225 24.0000MF15X-AC
Y? = CMP-0447-00001-4: Crystal 32.768kHz ±20ppm (Tol) 12.5pF FUND 70kΩ 2-Pin CSMD T/R; ESR (Equivalent Series Resistance): 70kR; Radiation Hardening: No; Frequency: 32.768kHz; Length: 3.2mm; Max Operating Temperature: 85°C; Number of Pins: 2; Series: ABS07; Min Operating Temperature: -40°C; Frequency Tolerance: 20ppm; Packaging: Tape and Reel; Height: 0.9mm; Width: 1.5mm; Depth: 1.5mm; Load Capacitance: 12.5pF; RoHS Compliant: Yes; Tolerance: 20ppm; Termination: SMD/SMT; Lead Free: Lead Free; Series Resistance: 70kR; REACH SVHC: No SVHC; Case/Package: CSMD; Operating Frequency: 32.768 kHz; Package Quantity: 3000

## Nets that join several sheets
+3V3: Optical_Frontend (28 pins), LiDAR_Microcontroller (23 pins)
GND: Optical_Frontend (40 pins), LiDAR_Microcontroller (51 pins)
SPI1_MISO: Optical_Frontend (U?#2.9 U?#7.9), LiDAR_Microcontroller (stmU?#2.20)
SPI1_MOSI: Optical_Frontend (U?#2.10 U?#7.10 U?#10.3), LiDAR_Microcontroller (stmU?#2.21)
SPI1_SCLK: Optical_Frontend (U?#2.12 U?#7.12 U?#10.2), LiDAR_Microcontroller (stmU?#2.19)
TDC_RX_CS: Optical_Frontend (U?#7.11), LiDAR_Microcontroller (stmU?#2.17)
TDC_TX_CS: Optical_Frontend (U?#2.11), LiDAR_Microcontroller (stmU?#2.18)